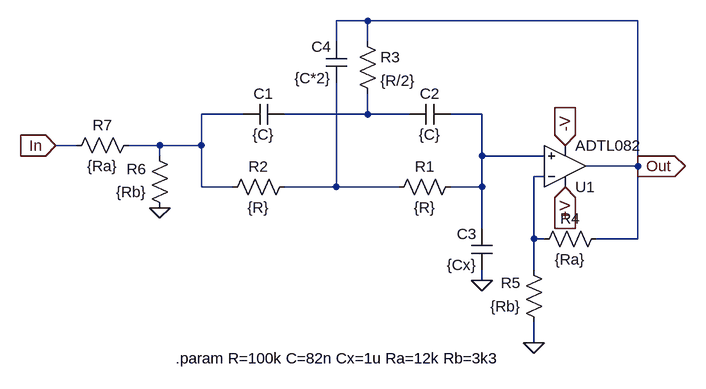
[diagram p0: schematic dobleT.asc]
dobleT.asc, the LTspice schematic file:
Version 4
SHEET 1 2524 768
WIRE -112 -48 -160 -48
WIRE 304 -48 -112 -48
WIRE -160 -16 -160 -48
WIRE -112 -16 -112 -48
WIRE -304 96 -368 96
WIRE -112 96 -112 64
WIRE -112 96 -240 96
WIRE -48 96 -112 96
WIRE 64 96 16 96
WIRE -560 144 -592 144
WIRE -432 144 -480 144
WIRE -368 144 -368 96
WIRE -368 144 -432 144
WIRE -432 160 -432 144
WIRE 64 160 64 96
WIRE 160 160 64 160
WIRE 304 176 304 -48
WIRE 304 176 224 176
WIRE 160 192 144 192
WIRE -368 208 -368 144
WIRE -320 208 -368 208
WIRE -160 208 -160 48
WIRE -160 208 -240 208
WIRE -64 208 -160 208
WIRE 64 208 64 160
WIRE 64 208 16 208
WIRE 64 272 64 208
WIRE 144 288 144 192
WIRE 160 288 144 288
WIRE 304 288 304 176
WIRE 304 288 240 288
WIRE 144 336 144 288
WIRE 64 352 64 336
WIRE 144 448 144 416
FLAG 64 352 0
FLAG 144 448 0
FLAG 192 208 +V
IOPIN 192 208 In
FLAG 192 144 -V
IOPIN 192 144 In
FLAG -592 144 In
IOPIN -592 144 In
FLAG 304 176 Out
IOPIN 304 176 Out
FLAG -432 240 0
SYMBOL Opamps\\ADTL082 192 240 M180
SYMATTR InstName U1
SYMBOL res 32 192 R90
WINDOW 0 0 56 VBottom 2
WINDOW 3 32 56 VTop 2
SYMATTR InstName R1
SYMATTR Value {R}
SYMBOL res -224 192 R90
WINDOW 0 0 56 VBottom 2
WINDOW 3 32 56 VTop 2
SYMATTR InstName R2
SYMATTR Value {R}
SYMBOL res -128 -32 R0
SYMATTR InstName R3
SYMATTR Value {R/2}
SYMBOL cap -240 80 R90
WINDOW 0 0 32 VBottom 2
WINDOW 3 32 32 VTop 2
SYMATTR InstName C1
SYMATTR Value {C}
SYMBOL cap 16 80 R90
WINDOW 0 0 32 VBottom 2
WINDOW 3 32 32 VTop 2
SYMATTR InstName C2
SYMATTR Value {C}
SYMBOL cap 80 336 R180
WINDOW 0 24 56 Left 2
WINDOW 3 24 8 Left 2
SYMATTR InstName C3
SYMATTR Value {Cx}
SYMBOL cap -144 48 R180
WINDOW 0 24 56 Left 2
WINDOW 3 24 8 Left 2
SYMATTR InstName C4
SYMATTR Value {C*2}
SYMBOL res 256 272 R90
WINDOW 0 0 56 VBottom 2
WINDOW 3 32 56 VTop 2
SYMATTR InstName R4
SYMATTR Value {Ra}
SYMBOL res 160 432 R180
WINDOW 0 36 76 Left 2
WINDOW 3 36 40 Left 2
SYMATTR InstName R5
SYMATTR Value {Rb}
SYMBOL res -416 256 R180
WINDOW 0 36 76 Left 2
WINDOW 3 36 40 Left 2
SYMATTR InstName R6
SYMATTR Value {Rb}
SYMBOL res -576 160 R270
WINDOW 0 32 56 VTop 2
WINDOW 3 0 56 VBottom 2
SYMATTR InstName R7
SYMATTR Value {Ra}
TEXT -408 472 Left 2 !.param R=100k C=82n Cx=1u Ra=12k Rb=3k3

The netlist it stands for:
* dobleT.asc
XU1 N003 N004 +V -V Out ADTL082  ; pins In+ In- V+ V- OUT
R1 N003 N005 {R}
R2 N005 N001 {R}
R3 Out N002 {R/2}
C1 N002 N001 {C}
C2 N003 N002 {C}
C3 0 N003 {Cx}
C4 N005 Out {C*2}
R4 Out N004 {Ra}
R5 0 N004 {Rb}
R6 0 N001 {Rb}
R7 In N001 {Ra}
.param R=100k C=82n Cx=1u Ra=12k Rb=3k3
.lib ADI.lib
.backanno
.end